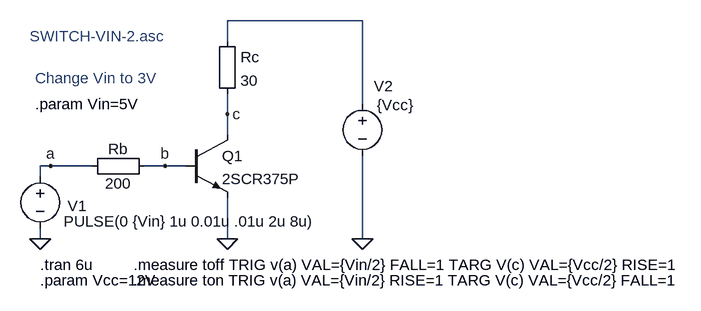
[diagram p0: schematic SWITCH-VIN-2.asc]
SWITCH-VIN-2.asc, the LTspice schematic file:
Version 4
SHEET 1 880 680
WIRE 416 -96 208 -96
WIRE 208 -64 208 -96
WIRE 416 32 416 -96
WIRE 208 48 208 16
WIRE 208 80 208 48
WIRE -64 128 -80 128
WIRE 0 128 -64 128
WIRE 112 128 80 128
WIRE 144 128 112 128
WIRE -80 144 -80 128
WIRE -80 240 -80 224
WIRE 208 240 208 176
WIRE 416 240 416 112
FLAG 208 240 0
FLAG -80 240 0
FLAG 416 240 0
FLAG -64 128 a
FLAG 208 48 c
FLAG 112 128 b
SYMBOL Misc\\EuropeanResistor 192 -80 R0
SYMATTR InstName Rc
SYMATTR Value 30
SYMBOL Misc\\EuropeanResistor 96 112 R90
WINDOW 0 5 56 VBottom 2
WINDOW 3 27 56 VTop 2
SYMATTR InstName Rb
SYMATTR Value 200
SYMBOL voltage -80 128 R0
WINDOW 3 36 85 Left 2
WINDOW 123 0 0 Left 2
WINDOW 39 0 0 Left 2
WINDOW 0 42 61 Left 2
SYMATTR Value PULSE(0 {Vin} 1u 0.01u .01u 2u 8u)
SYMATTR InstName V1
SYMBOL voltage 416 16 R0
WINDOW 3 22 18 Left 2
WINDOW 123 0 0 Left 2
WINDOW 39 0 0 Left 2
WINDOW 0 18 -11 Left 2
SYMATTR Value {Vcc}
SYMATTR InstName V2
SYMBOL npn 144 80 R0
SYMATTR InstName Q1
SYMATTR Value 2SCR375P
TEXT -80 280 Left 2 !.tran 6u
TEXT 64 280 Left 2 !.measure toff TRIG v(a) VAL={Vin/2} FALL=1 TARG V(c) VAL={Vcc/2} RISE=1
TEXT -80 304 Left 2 !.param Vcc=12V
TEXT 64 304 Left 2 !.measure ton TRIG v(a) VAL={Vin/2} RISE=1 TARG V(c) VAL={Vcc/2} FALL=1
TEXT -96 -72 Left 2 ;SWITCH-VIN-2.asc
TEXT -88 32 Left 2 !.param Vin=5V
TEXT -88 -8 Left 2 ;Change Vin to 3V

The netlist it stands for:
* SWITCH-VIN-2.asc
Rc N001 c 30
Rb b a 200
V1 a 0 PULSE(0 {Vin} 1u 0.01u .01u 2u 8u)
V2 N001 0 {Vcc}
Q1 c b 0 0 2SCR375P
.model NPN NPN
.model PNP PNP
.lib standard.bjt
.tran 6u
.measure toff TRIG v(a) VAL={Vin/2} FALL=1 TARG V(c) VAL={Vcc/2} RISE=1
.param Vcc=12V
.measure ton TRIG v(a) VAL={Vin/2} RISE=1 TARG V(c) VAL={Vcc/2} FALL=1
* SWITCH-VIN-2.asc
.param Vin=5V
* Change Vin to 3V
.backanno
.end